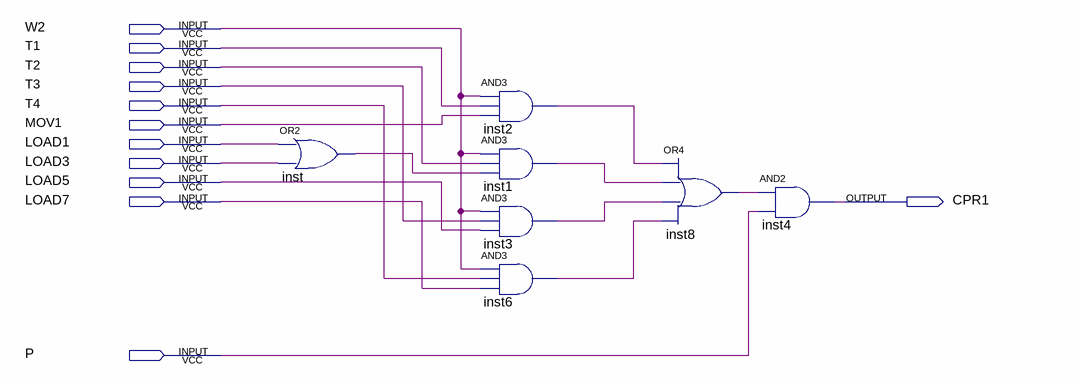
[diagram p0: schematic sheet]
// Quartus schematic CPR1.bdf as structural Verilog: 7 symbols, 12 pins
module CPR1 (
  input  W2,
  input  T1,
  input  T2,
  input  T3,
  input  T4,
  input  MOV1,
  input  LOAD1,
  input  LOAD3,
  input  LOAD5,
  input  LOAD7,
  input  P,
  output CPR1
);

  wire inst1_out, inst2_out, inst3_out, inst6_out, inst8_out, inst_out;

  or inst (inst_out, LOAD1, LOAD3);
  and inst2 (inst2_out, W2, T1, MOV1);
  and inst1 (inst1_out, W2, T2, inst_out);
  and inst3 (inst3_out, W2, T3, LOAD5);
  and inst6 (inst6_out, W2, T4, LOAD7);
  or inst8 (inst8_out, inst2_out, inst1_out, inst3_out, inst6_out);
  and inst4 (CPR1, inst8_out, P);
endmodule
